# Altium schematic sheet WL-RF-LNA.SchDoc
size 420 x 297 mm; Address1: Address1; Address2: Address2; Address3: Address3; Address4: Address4; DocumentNumber: WOLF-RF-UNIT; SheetNumber: 4; Scale: 1:1; DocumentType: Схема электрическая принципиальная; FirstReferrence: АБВГ.123456.001
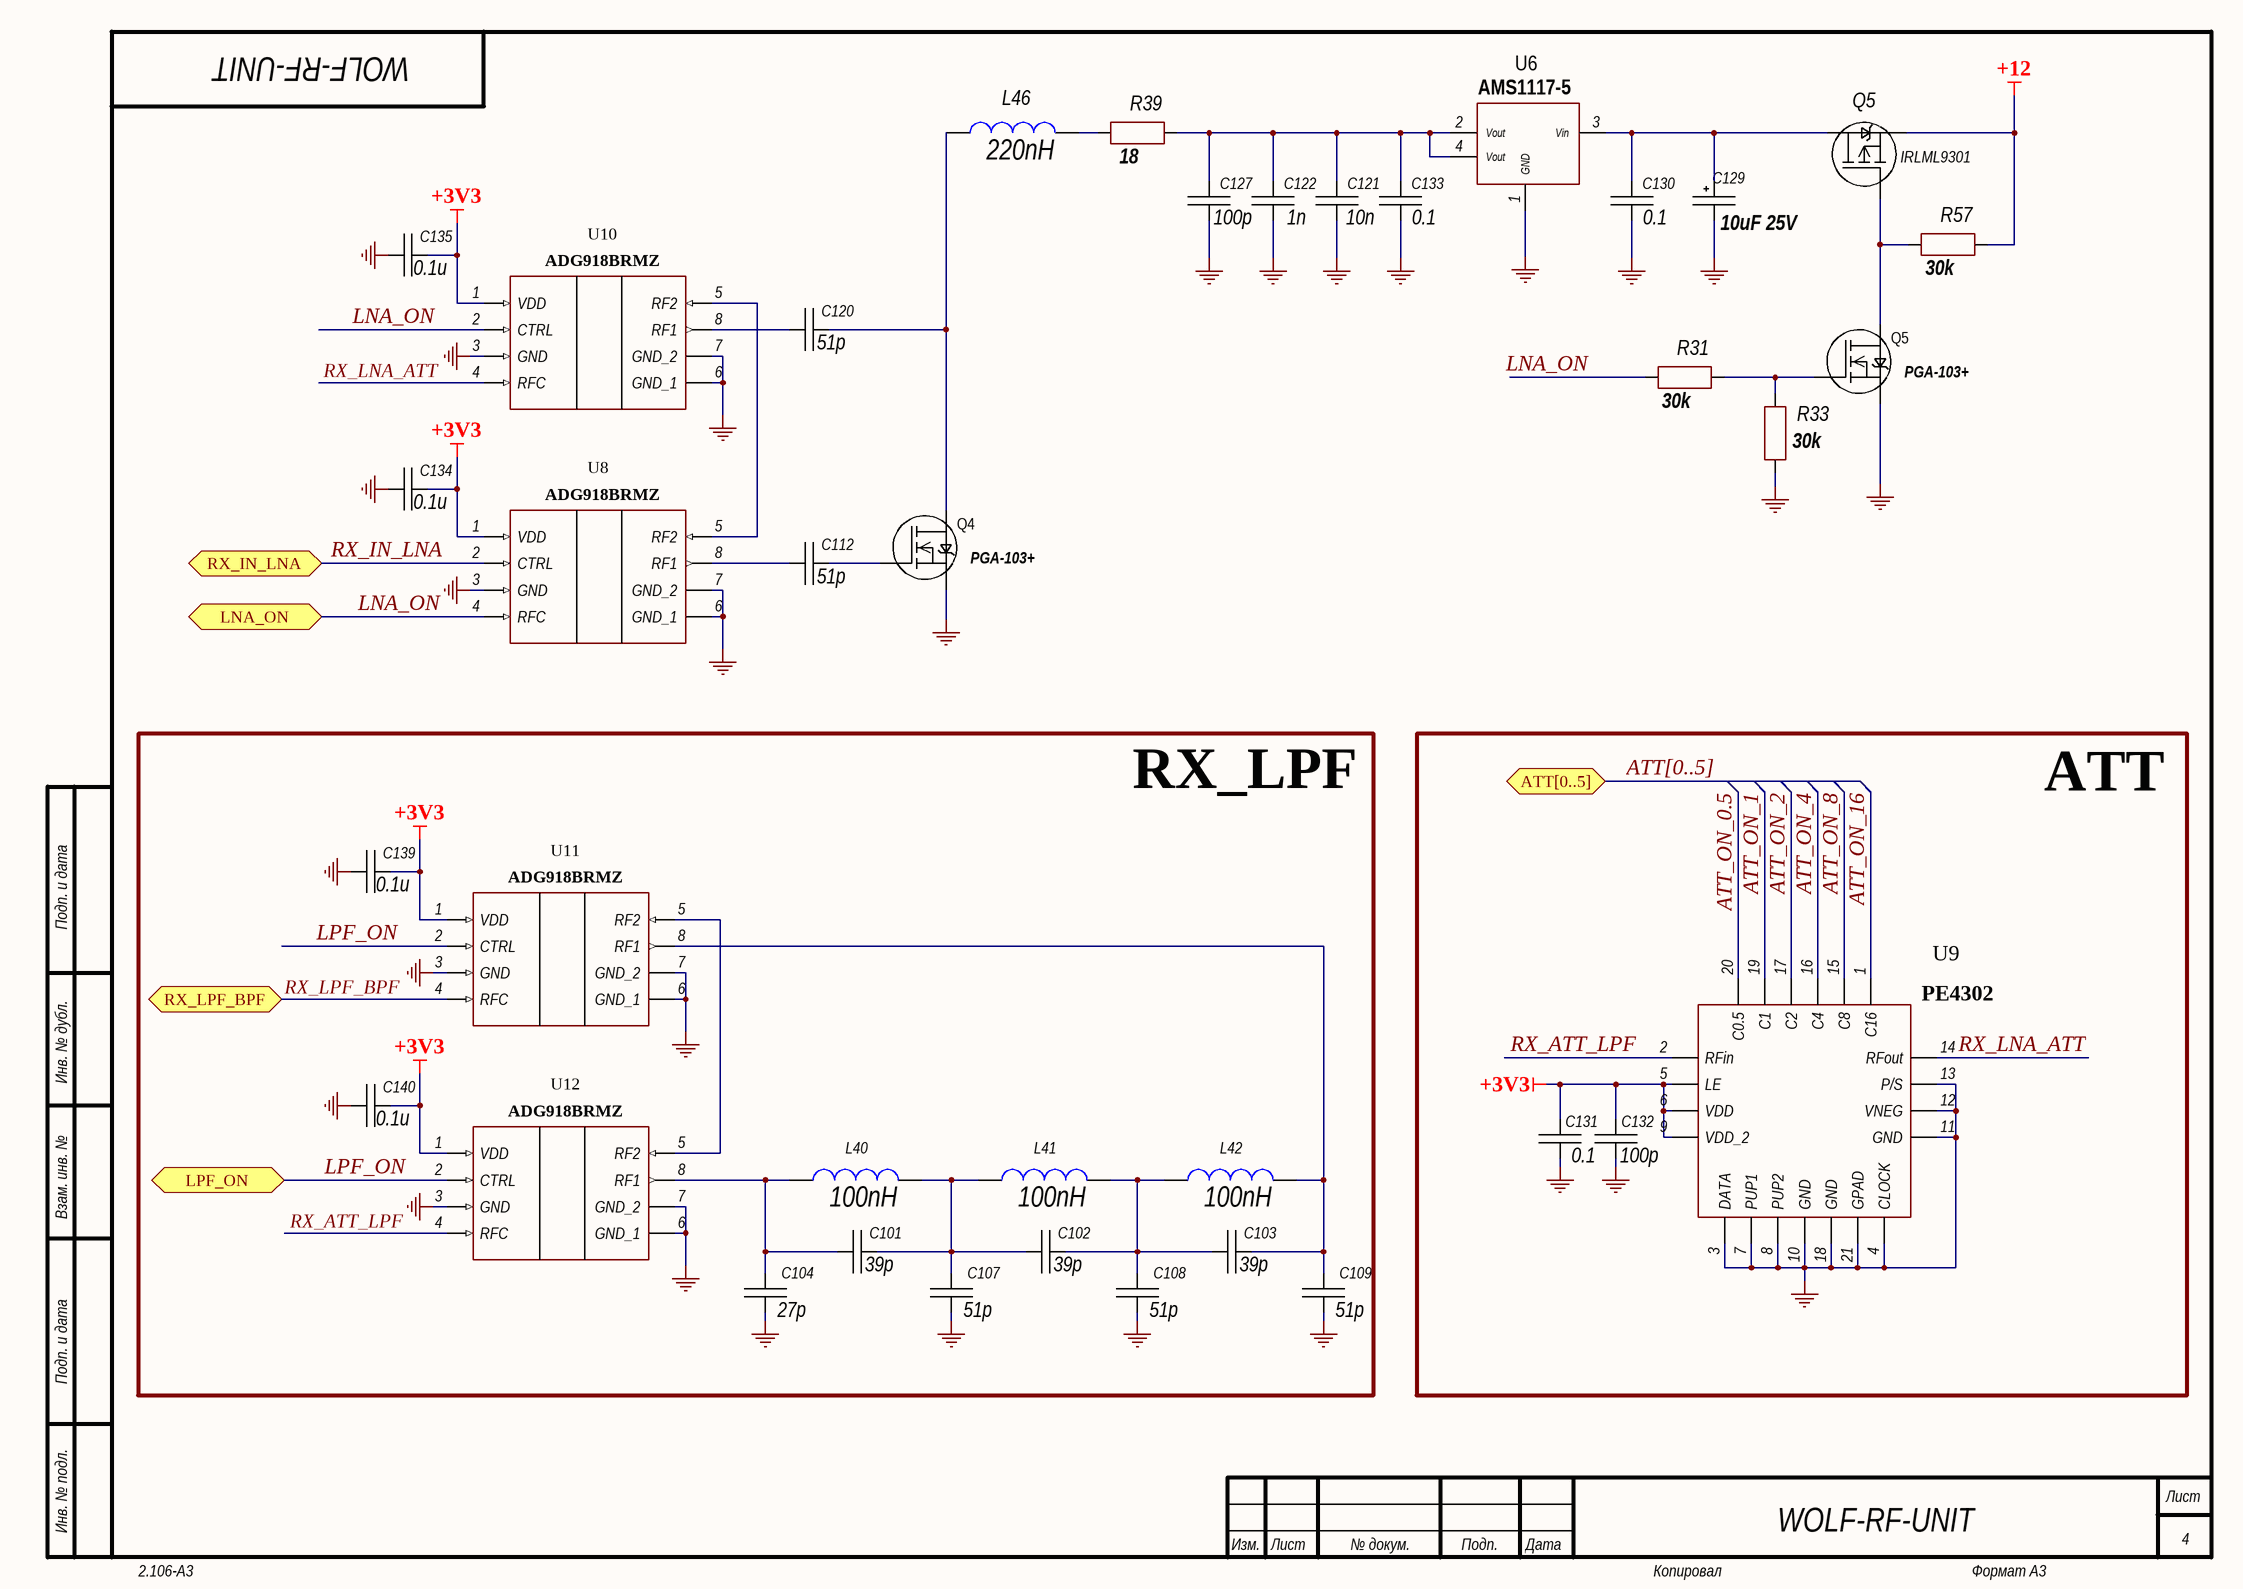
[diagram p0: WL-RF-LNA.SchDoc]

## Parts
(Parts that share a designator on the sheet are numbered #1, #2 ... from top to bottom, then left to right.)
C101  39p  [CH0805C]
C102  39p  [CH0805C]
C103  39p  [CH0805C]
C104  27p  [CH0805C]
C107  51p  [CH0805C]
C108  51p  [CH0805C]
C109  51p  [CH0805C]
C112  51p  [CH0805C]
C120  51p  [CH0805C]
C121  10n  [CH0805C]
C122  1n  [CH0805C]
C127  100p  [CH0805C]
C129  10uF 25V  [TANTAL_B]
C130  0.1  [CH0805C]
C131  0.1  [CH0805C]
C132  100p  [CH0805C]
C133  0.1  [CH0805C]
C134  0.1u  [CH0805C]
C135  0.1u  [CH0805C]
C139  0.1u  [CH0805C]
C140  0.1u  [CH0805C]
L40  100nH  [IND: R24]
L41  100nH  [IND: R24]
L42  100nH  [IND: R24]
L46  220nH  [IND: R24]
Q4  PGA-103+  [SOT23_132]
Q5#1  IRLML9301  [D2PAK_132]
Q5#2  PGA-103+  [SOT23_132]
R31  30k  [CH0805R]
R33  30k  [CH0805R]
R39  18  [CH0805R]
R57  30k  [CH0805R]
U6  AMS1117-5  [SOT223]
U8  ADG918BRMZ  [8-MSOP (NO PAD)]
U9  PE4302
U10  ADG918BRMZ  [8-MSOP (NO PAD)]
U11  ADG918BRMZ  [8-MSOP (NO PAD)]
U12  ADG918BRMZ  [8-MSOP (NO PAD)]

## Blocks framed on the sheet
RX_LPF: C101-C104 C107-C109 C139 C140 L40-L42 U11 U12
ATT: C131 C132 U9

## Ports
ATT[0..5] (bidir), LNA_ON (bidir), LPF_ON (bidir), RX_IN_LNA (bidir), RX_LPF_BPF (bidir)

## Nets
+3V3: C131.1 C132.1 C134.1 C135.1 C139.1 C140.1 U8.1(VDD) U9.5(LE) U9.6(VDD) U9.9(VDD_2) U10.1(VDD) U11.1(VDD) U12.1(VDD)
+12: Q5#1.2(I) R57.1
GND: C104.2 C107.2 C108.2 C109.2 C121.2 C122.2 C127.2 C129.2 C130.2 C131.2 C132.2 C133.2 C134.2 C135.2 C139.2 C140.2 Q4.2(I) Q5#2.2(I) R33.2 U6.1(GND) U8.3(GND) U8.6(GND_1) U8.7(GND_2) U9.3(DATA) U9.4(CLOCK) U9.7(PUP1) U9.8(PUP2) U9.10(GND) U9.11(GND) U9.12(VNEG) U9.13(P/S) U9.18(GND) U9.21(GPAD) U10.3(GND) U10.6(GND_1) U10.7(GND_2) U11.3(GND) U11.6(GND_1) U11.7(GND_2) U12.3(GND) U12.6(GND_1) U12.7(GND_2)
ATT_ON_0.5: U9.20(C0.5)
ATT_ON_1: U9.19(C1)
ATT_ON_2: U9.17(C2)
ATT_ON_4: U9.16(C4)
ATT_ON_8: U9.15(C8)
ATT_ON_16: U9.1(C16)
LNA_ON: R31.2 U8.4(RFC) U10.2(CTRL) ; port LNA_ON
LPF_ON: U11.2(CTRL) U12.2(CTRL) ; port LPF_ON
RX_ATT_LPF: U9.2(RFin) U12.4(RFC)
RX_IN_LNA: U8.2(CTRL) ; port RX_IN_LNA
RX_LNA_ATT: U9.14(RFout) U10.4(RFC)
RX_LPF_BPF: U11.4(RFC) ; port RX_LPF_BPF
NetC101_1: C101.1 C102.2 C107.1 L40.1 L41.2
NetC101_2: C101.2 C104.1 L40.2 U12.8(RF1)
NetC102_1: C102.1 C103.2 C108.1 L41.1 L42.2
NetC103_1: C103.1 C109.1 L42.1 U11.8(RF1)
NetC112_1: C112.1 Q4.1(Затвор(Gate))
NetC112_2: C112.2 U8.8(RF1)
NetC120_1: C120.1 L46.2 Q4.3(Сток(Drain))
NetC120_2: C120.2 U10.8(RF1)
NetC121_1: C121.1 C122.1 C127.1 C133.1 R39.1 U6.2(Vout) U6.4(Vout)
NetC129_1: C129.1 C130.1 Q5#1.3(Сток(Drain)) U6.3(Vin)
NetL46_1: L46.1 R39.2
NetQ5#1_1: Q5#1.1(Затвор(Gate)) Q5#2.3(Сток(Drain)) R57.2
NetQ5#2_1: Q5#2.1(Затвор(Gate)) R31.1 R33.1
NetU8_5: U8.5(RF2) U10.5(RF2)
NetU11_5: U11.5(RF2) U12.5(RF2)

## Buses and harness runs
bus ATT[0..5] = port ATT[0..5]

## Notes on the sheet
- Подп. и дата
- Инв. № дубл.
- Взам. инв. №
- Инв. № подл.
- Изм.
- Лист
- № докум.
- Подп.
- Дата
- 2.106-A3
- Копировал
- Формат А3

## Library data of the parts
C101-C104 C107-C109 C112 C120-C122 C127 C130-C135 C139 C140 = Capacitor: Manufacturer: *; Model: *; HelpURL: *; ComponentKind: *; Value: *
C129 = TantalCap: Manufacturer: *; Model: *; HelpURL: *; ComponentKind: *; Value: *
L40-L42 L46 = Inductor ring: Value: {Value}; Model: *; ComponentKind: *; Manufacturer: *; HelpURL: *
Q4 Q5#2 = N-KANAL
Q5#1 = P-KANAL
R31 R33 R39 R57 = Resistor: Manufacturer: *; Model: *; HelpURL: *; ComponentKind: *; Value: *
U6 = AMS117